# EAGLE design powerlinecontroller (EAGLE 5.08)
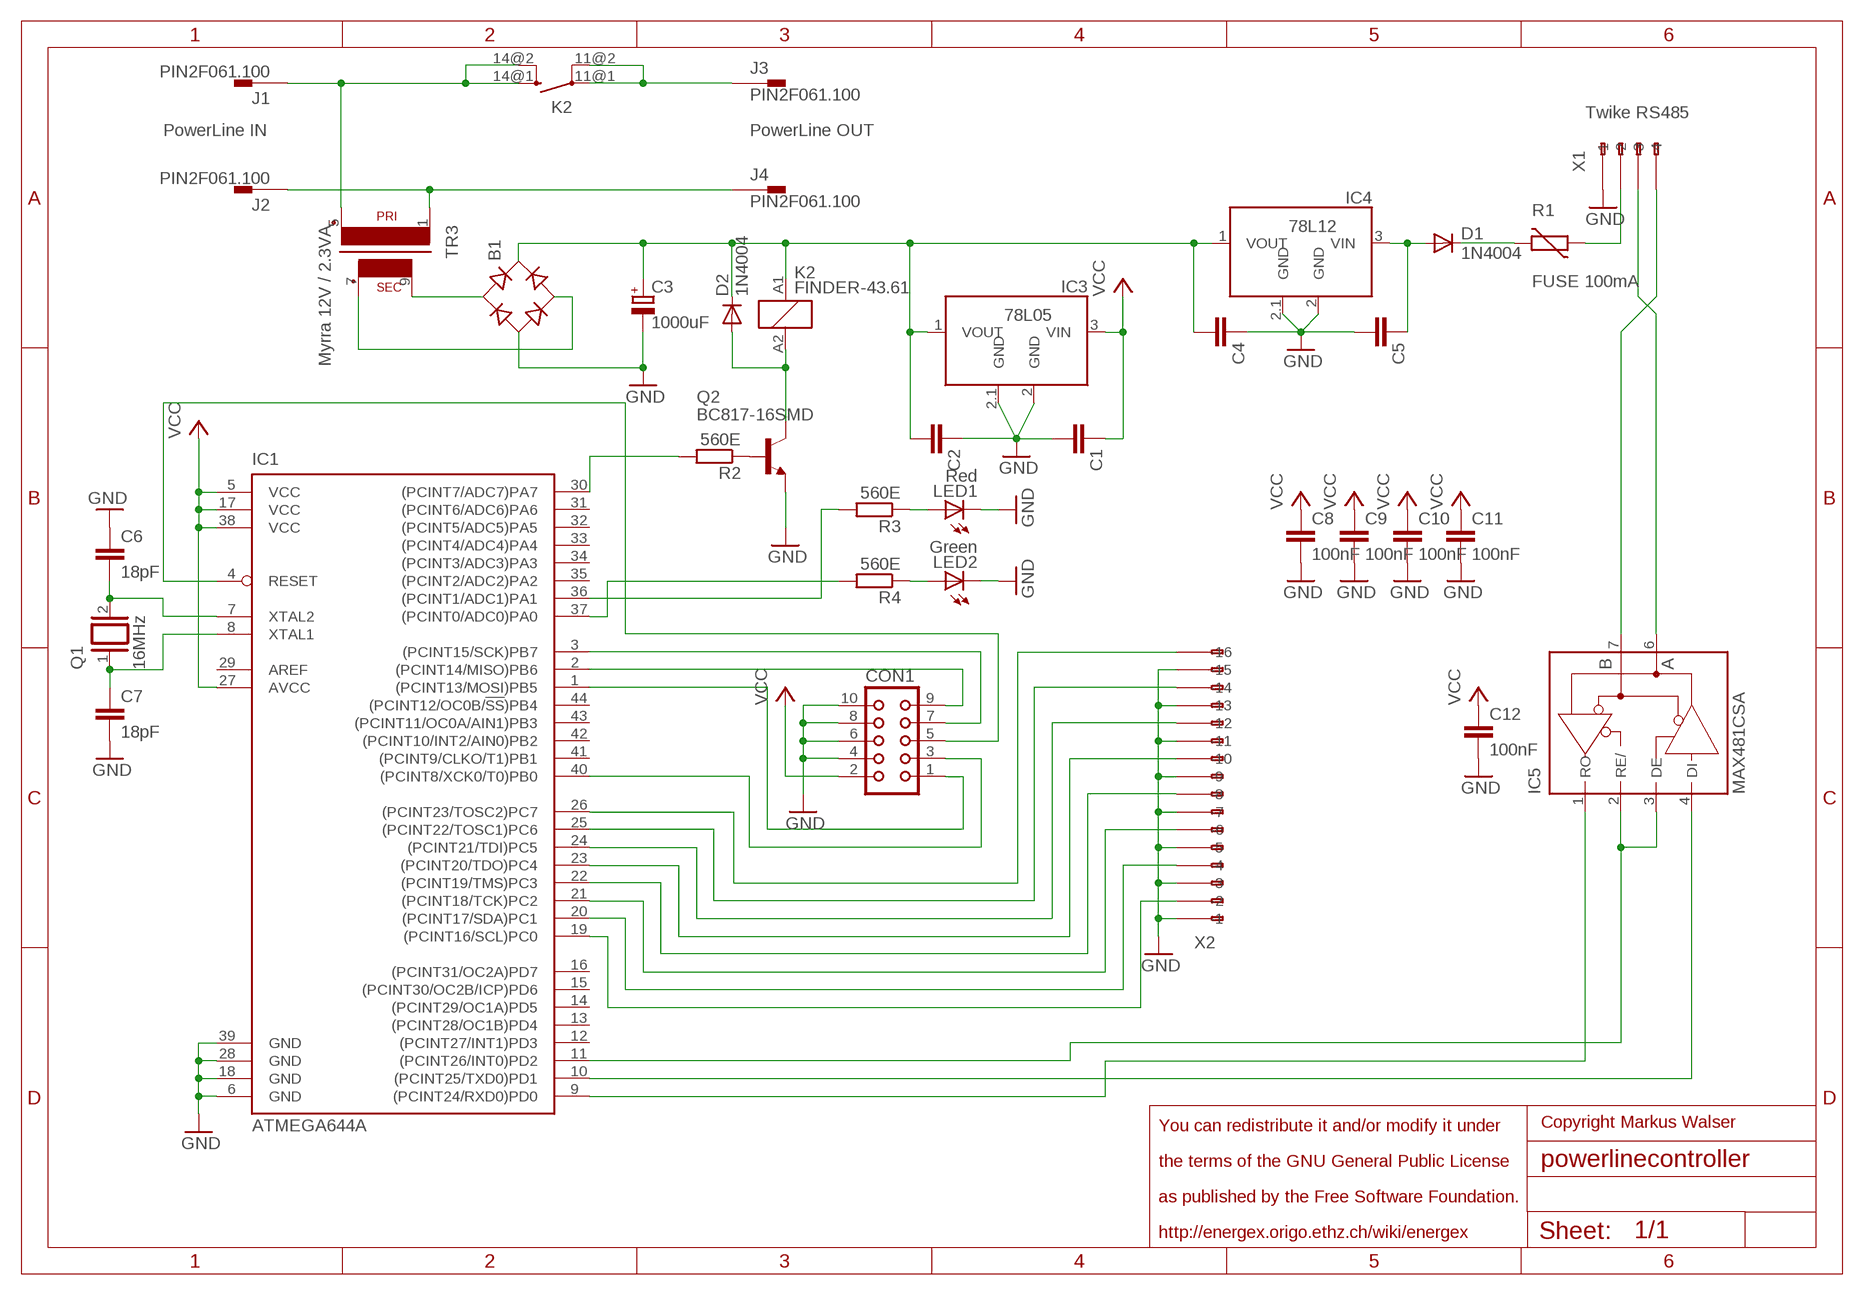
[diagram p0: schematic, sheet 1]

## Parts
B1  B-DIL  [B-DIL]
C1  C-EUC0603  [C0603]
C2  C-EUC0603  [C0603]
C3  1000uF  CPOL-EUE3.5-10  [E3,5-10]
C4  C-EUC0603  [C0603]
C5  C-EUC0603  [C0603]
C6  18pF  C-EUC0603K  [C0603K]
C7  18pF  C-EUC0603K  [C0603K]
C8  100nF  C-EUC0603  [C0603]
C9  100nF  C-EUC0603  [C0603]
C10  100nF  C-EUC0603  [C0603]
C11  100nF  C-EUC0603  [C0603]
C12  100nF  C-EUC0603  [C0603]
CON1  CON10  [CON10]
D1  1N4004  [DO41-10]
D2  1N4004  [DO41-10]
IC1  ATMEGA644A  [TQFP44]
IC3  78L05  [SOT89]
IC4  78L12  78L05  [SOT89]
IC5  MAX481CSA  [SO08]
J1  PIN2F061.100  [F061.100]
J2  PIN2F061.100  [F061.100]
J3  PIN2F061.100  [F061.100]
J4  PIN2F061.100  [F061.100]
K2  FINDER-43.61  [FINDER-43.61]
LED1  Red  LEDCHIPLED_0805  [CHIPLED_0805]
LED2  Green  LEDCHIPLED_0805  [CHIPLED_0805]
Q1  16MHz  XTAL/S  [QS]
Q2  BC817-16SMD  [SOT23-BEC]
R1  FUSE 100mA  VARISTORCN0805  [CT/CN0805]
R2  560E  R-EU_M0805  [M0805]
R3  560E  R-EU_M0805  [M0805]
R4  560E  R-EU_M0805  [M0805]
TR3  Myrra 12V / 2.3VA  VV11  [VV11]
X1  233-104  [233-104]
X2  233-116  [233-116]

## Nets
GND: B1.- C1.2 C2.1 C3.- C4.1 C5.2 C6.1 C7.2 C8.2 C9.2 C10.2 C11.2 C12.2 CON1.4 CON1.6 CON1.8 CON1.10 IC1.6(GND) IC1.18(GND) IC1.28(GND) IC1.39(GND) IC3.2(GND) IC3.2.1(GND) IC4.2(GND) IC4.2.1(GND) LED1.C LED2.C Q2.E X1.A1(-1) X2.A1(-1) X2.A3(-3) X2.A5(-5) X2.A7(-7) X2.A9(-9) X2.A11(-11) X2.A13(-13) X2.A15(-15)
N$1: IC1.9((PCINT24/RXD0)PD0) IC5.1(RO)
N$2: IC1.10((PCINT25/TXD0)PD1) IC5.4(DI)
N$3: D1.C R1.2
N$4: R1.1 X1.A2(-2)
N$5: B1.+ C2.2 C3.+ C4.2 D2.C IC3.1(VOUT) IC4.1(VOUT) K2.A1
N$6: J2.A1 J4.A1 TR3.1
N$7: J1.A1 K2.14@1(-1:SA) K2.14@2(-1:SB) TR3.5(P2)
N$8: J3.A1 K2.11@1(-1:PA) K2.11@2(-1:PB)
N$9: B1.AC1 TR3.9(S4)
N$10: B1.AC2 TR3.7(S3)
N$11: IC5.6(A) X1.A3(-3)
N$12: C5.1 D1.A IC4.3(VIN)
N$13: IC5.7(B) X1.A4(-4)
N$14: C6.2 IC1.7(XTAL2) Q1.2
N$15: C7.1 IC1.8(XTAL1) Q1.1
N$16: Q2.B R2.1
N$17: CON1.1 IC1.1((PCINT13/MOSI)PB5)
N$18: CON1.3 IC1.40((PCINT8/XCK0/T0)PB0)
N$19: CON1.5 IC1.4(RESET)
N$20: CON1.7 IC1.3((PCINT15/SCK)PB7)
N$21: CON1.9 IC1.2((PCINT14/MISO)PB6)
N$22: D2.A K2.A2 Q2.C
N$23: IC1.30((PCINT7/ADC7)PA7) R2.2
N$24: IC1.37((PCINT0/ADC0)PA0) R4.2
N$25: IC1.36((PCINT1/ADC1)PA1) R3.2
N$26: LED1.A R3.1
N$27: LED2.A R4.1
N$28: IC1.19((PCINT16/SCL)PC0) X2.A2(-2)
N$29: IC1.20((PCINT17/SDA)PC1) X2.A4(-4)
N$30: IC1.21((PCINT18/TCK)PC2) X2.A6(-6)
N$31: IC1.22((PCINT19/TMS)PC3) X2.A8(-8)
N$32: IC1.23((PCINT20/TDO)PC4) X2.A10(-10)
N$33: IC1.24((PCINT21/TDI)PC5) X2.A12(-12)
N$34: IC1.11((PCINT26/INT0)PD2) IC5.2(RE/) IC5.3(DE)
N$35: IC1.25((PCINT22/TOSC1)PC6) X2.A14(-14)
N$36: IC1.26((PCINT23/TOSC2)PC7) X2.A16(-16)
VCC: C1.1 C8.1 C9.1 C10.1 C11.1 C12.1 CON1.2 IC1.5(VCC) IC1.17(VCC) IC1.27(AVCC) IC1.38(VCC) IC3.3(VIN)
Unconnected: IC1.12((PCINT27/INT1)PD3) IC1.13((PCINT28/OC1B)PD4) IC1.14((PCINT29/OC1A)PD5) IC1.15((PCINT30/OC2B/ICP)PD6) IC1.16((PCINT31/OC2A)PD7) IC1.29(AREF) IC1.31((PCINT6/ADC6)PA6) IC1.32((PCINT5/ADC5)PA5) IC1.33((PCINT4/ADC4)PA4) IC1.34((PCINT3/ADC3)PA3) IC1.35((PCINT2/ADC2)PA2) IC1.41((PCINT9/CLKO/T1)PB1) IC1.42((PCINT10/INT2/AIN0)PB2) IC1.43((PCINT11/OC0A/AIN1)PB3) IC1.44((PCINT12/OC0B/!SS!)PB4) J1.A2(1.1) J2.A2(1.1) J3.A2(1.1) J4.A2(1.1) X1.B1(B-1) X1.B2(B-2) X1.B3(B-3) X1.B4(B-4) X2.B1(B-1) X2.B2(B-2) X2.B3(B-3) X2.B4(B-4) X2.B5(B-5) X2.B6(B-6) X2.B7(B-7) X2.B8(B-8) X2.B9(B-9) X2.B10(B-10) X2.B11(B-11) X2.B12(B-12) X2.B13(B-13) X2.B14(B-14) X2.B15(B-15) X2.B16(B-16)

## Notes on the sheet
- Twike RS485
- PowerLine IN | PowerLine OUT
- You can redistribute it and/or modify it under | Copyright Markus Walser
- the terms of the GNU General Public License
- as published by the Free Software Foundation.
- http://energex.origo.ethz.ch/wiki/energex

## Power pins joined to a net without a drawn wire
GND: IC5.5(GND)
VCC: IC5.8(VCC)

## Library data of the parts
B1 = rectifier:B-DIL: RECTIFIER
C1 C2 C4-C12 = rcl:C-EU: CAPACITOR, European symbol
C3 = rcl:CPOL-EU: POLARIZED CAPACITOR, European symbol
CON1 = con-harting:CON10: CONNECTOR
D1 D2 = diode:1N4004: DIODE general purpose rectifier, 1 A
IC1 = atmel:ATMEGA644: 8-bit Microcontroller with 64K Bytes In-System Programmable Flash Source: http://www.atmel.com/dyn/resources/prod_documents/doc2593.pdf
IC3 IC4 = supervisor:78L05: Negative voltage regulators
IC5 = maxim:MAX481CSA: RS485 TRANSEIVER
J1-J4 = con-faston:PIN2: Flachstecker Typ Tyco/Electronics/AMP TAB, FASTON Printed Circuit Board Tabs Source: http://www.buerklin.com, http://catalog.tycoelectronics.com
K2 = relay:FINDER-43.61: Low profile PCB relays 10 - 16 A FINDER 43 Series Kontakt max. AC- 250V, Strom - Kontakt AC- max. 10A 5 mm contact pin pitch, 1 Pole NO, 16 A, PCB mount Distributor: FARNELL Source: http://www.farnell.com/datasheets/87682.pdf
LED1 LED2 = led:LED: LED OSRAM: - CHIPLED LG R971, LG N971, LY N971, LG Q971, LY Q971, LO R971, LY R971 LH N974, LH R974 LS Q976, LO Q976, LY Q976 LO Q996 - Hyper CHIPLED LW Q18S LB Q993, LB Q99A, LB R99A - SideLED LS A670, LO A670, LY A670, LG A670, LP A670 LB A673, LV A673, LT A673, LW A673 LH A674 LY A675 LS A676, LA A676, LO A676, LY A676, LW A676 LS A679, LY A679, LG A679 - Hyper Micro SIDELED® LS Y876, LA Y876, LO Y876, LY Y876 LT Y87S - SmartLED LW L88C, LW L88S LB L89C, LB L89S, LG L890 LS L89K, LO L89K, LY L89K LS L896, LA L896, LO L896, LY L896 - TOPLED LS T670, LO T670, LY T670, LG T670, LP T670 LSG T670, LSP T670, LSY T670, LOP T670, LYG T670 LG T671, LOG T671, LSG T671 LB T673, LV T673, LT T673, LW T673 LH T674 LS T676, LA T676, LO T676, LY T676, LB T676, LH T676, LSB T676, LW T676 LB T67C, LV T67C, LT T67C, LS T67K, LO T67K, LY T67K, LW E67C LS E67B, LA E67B, LO E67B, LY E67B, LB E67C, LV E67C, LT E67C LW T67C LS T679, LY T679, LG T679 LS T770, LO T770, LY T770, LG T770, LP T770 LB T773, LV T773, LT T773, LW T773 LH T774 LS E675, LA E675, LY E675, LS T675 LS T776, LA T776, LO T776, LY T776, LB T776 LHGB T686 LT T68C, LB T68C - Hyper Mini TOPLED® LB M676 - Mini TOPLED Santana® LG M470 LS M47K, LO M47K, LY M47K Source: http://www.osram.convergy.de LUXEON: - LUMILED® LXK2-PW12-R00, LXK2-PW12-S00, LXK2-PW14-U00, LXK2-PW14-V00 LXK2-PM12-R00, LXK2-PM12-S00, LXK2-PM14-U00 LXK2-PE12-Q00, LXK2-PE12-R00, LXK2-PE12-S00, LXK2-PE14-T00, LXK2-PE14-U00 LXK2-PB12-K00, LXK2-PB12-L00, LXK2-PB12-M00, LXK2-PB14-N00, LXK2-PB14-P00, LXK2-PB14-Q00 LXK2-PR12-L00, LXK2-PR12-M00, LXK2-PR14-Q00, LXK2-PR14-R00 LXK2-PD12-Q00, LXK2-PD12-R00, LXK2-PD12-S00 LXK2-PH12-R00, LXK2-PH12-S00 LXK2-PL12-P00, LXK2-PL12-Q00, LXK2-PL12-R00 Source: www.luxeon.com KINGBRIGHT: KA-3528ASYC Source: www.kingbright.com
Q1 = special:XTAL/S: CRYSTAL
Q2 = transistor-npn:BC817*: NPN Transistor
R1 = varistor:VARISTOR: VARISTOR
R2-R4 = rcl:R-EU_: RESISTOR, European symbol
TR3 = trafo:VV11: TRANSFORMER 1 primary winding, 1 secondary winding BLOCK
X1 = con-wago:233-104: WAGO Cage Clamp
X2 = con-wago:233-116: WAGO Cage Clamp

## Board
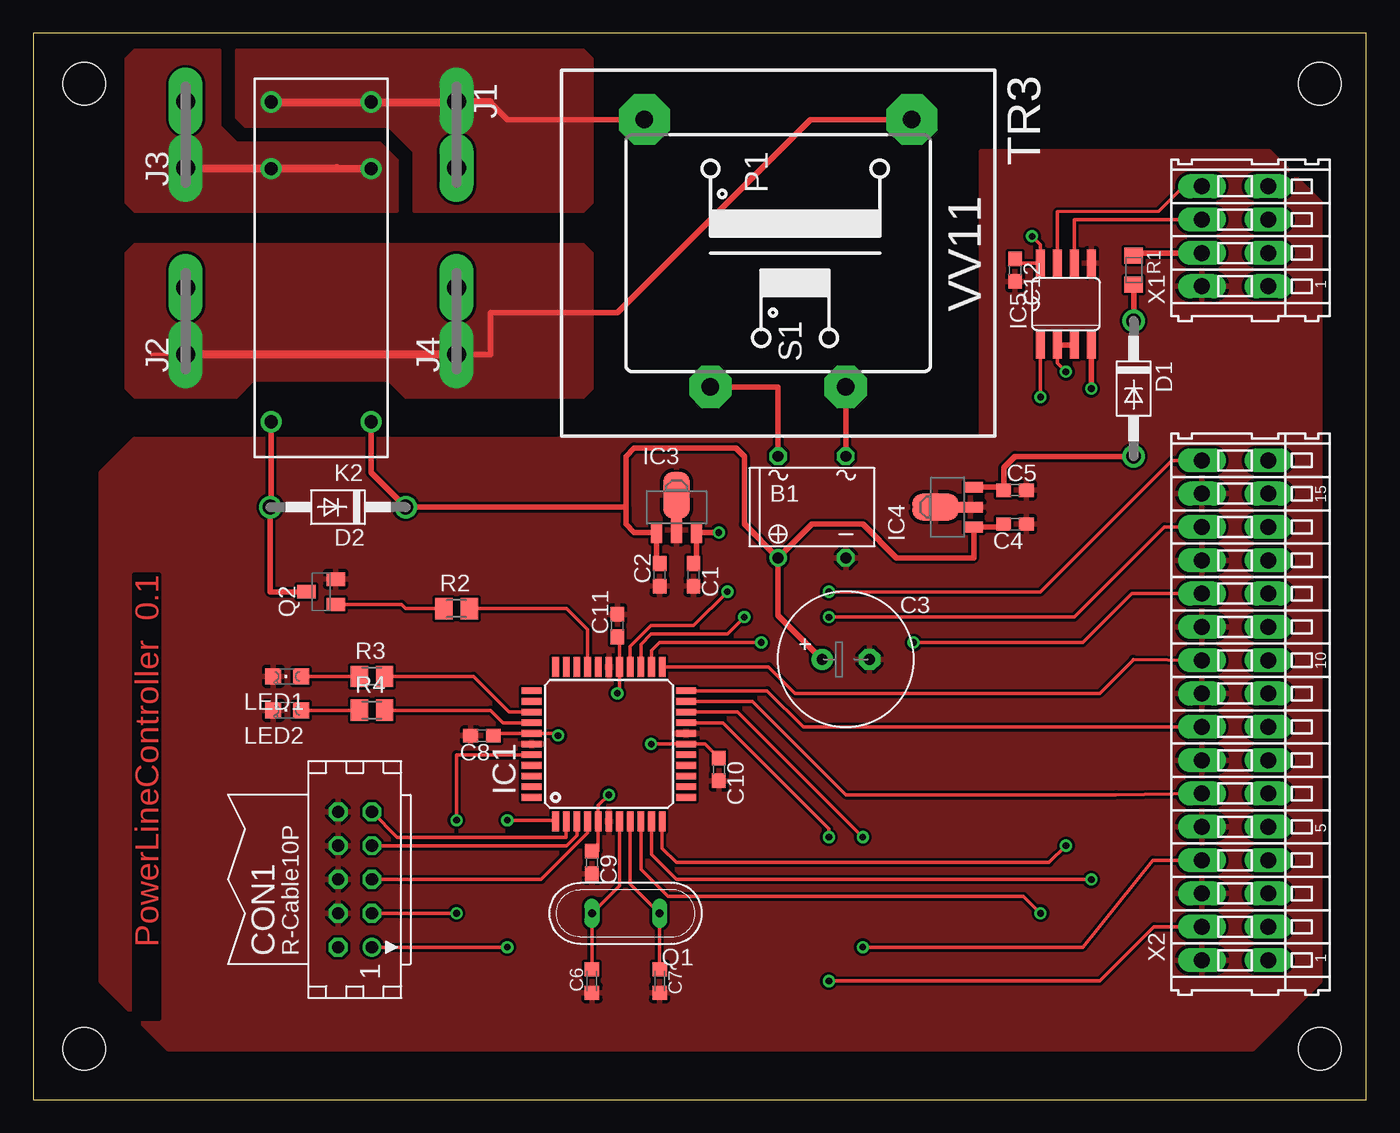
[diagram p1: board, top side]
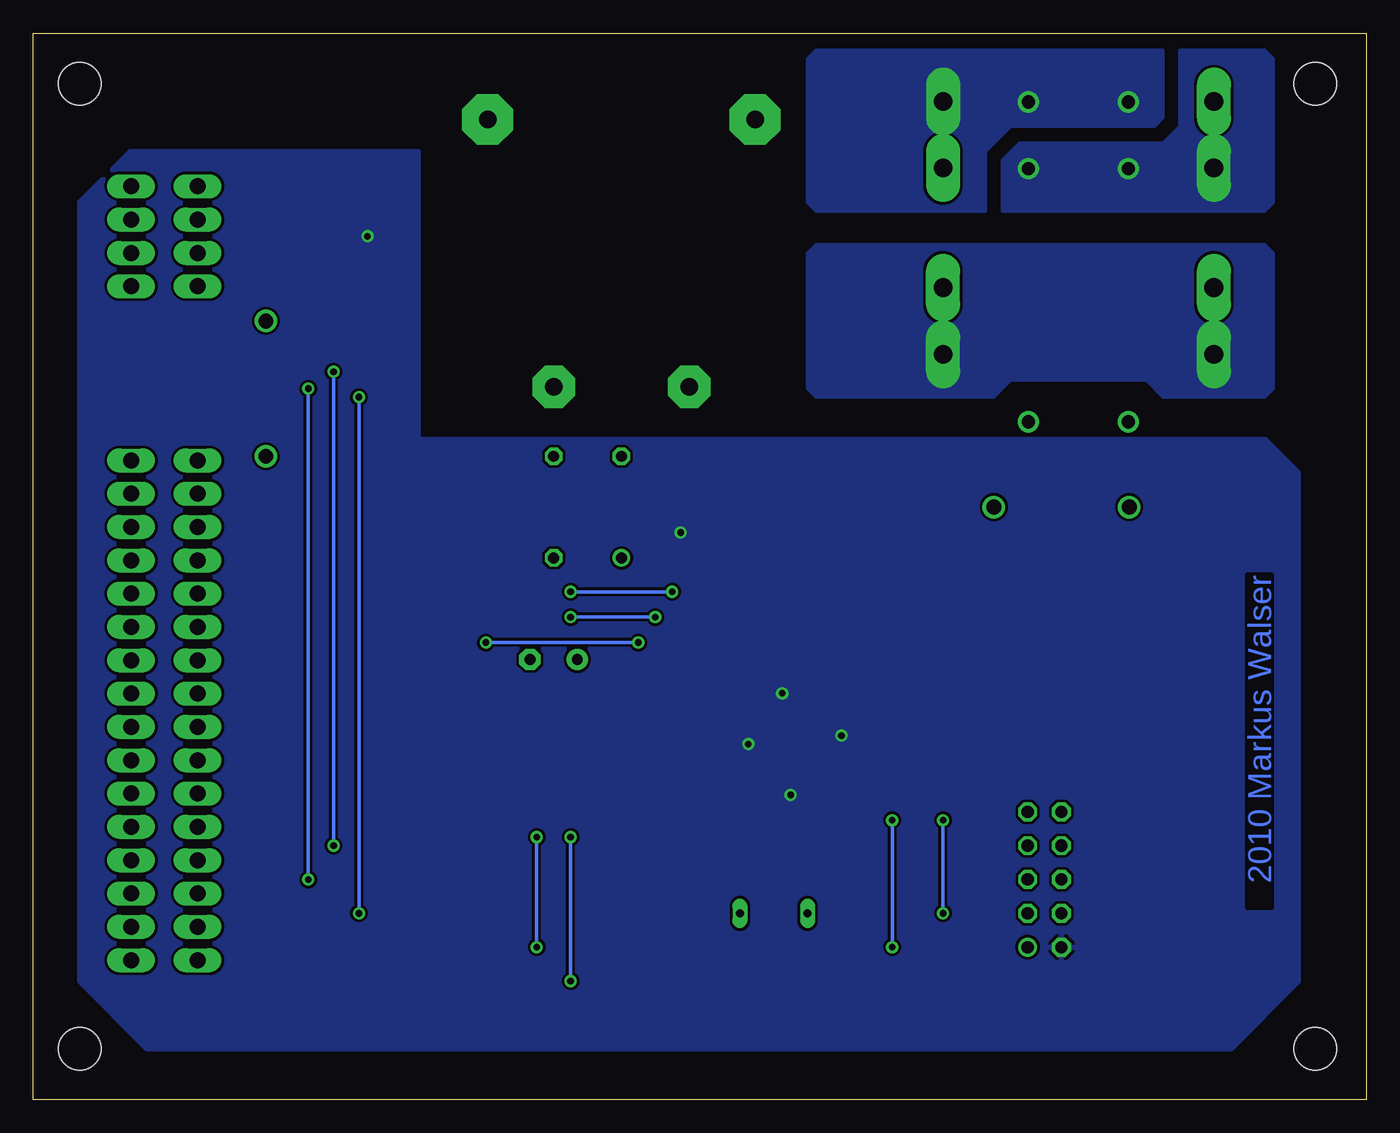
[diagram p2: board, bottom side, seen from below]

Size 100 x 80 mm. Coordinates in mm from the lower left corner, seen from the top.
Outline: 0,0 100,0 100,80 0,80 0,0
Copper layers (1*16): Top 0.035mm / dielectric 1.5mm / Bottom 0.035mm
Design rules "default": minimum track width 10mil, minimum drill 24mil, track to track 8mil, track to pad 8mil, pad to pad 8mil, via to via 8mil, smd to smd 8mil, copper to edge 40mil, drill to drill 8mil, minimum pad ring 10mil, minimum via ring 8mil, stop-mask expansion 4mil, vias tented up to drill 0mil, thermal gap 10mil
Holes 3.2 mm at 3.81,76.2 96.52,76.2 96.52,3.81 3.81,3.81

### Footprints (pad centres in the part's own frame; a part is rotated, then mirrored left to right if it is on the bottom)
B-DIL = drill 0.813 round: + -2.54,-3.81 | drill 0.813 octagon: - 2.54,-3.81; AC1 2.54,3.81; AC2 -2.54,3.81
C0603 = smd 1.1 x 1: 1 -0.85,0; 2 0.85,0
E3,5-10 = drill 0.813 pad 1.6 round: + -1.778,0 | drill 0.813 pad 1.6 octagon: - 1.778,0
C0603K = smd 1.05 x 1.08: 1 -0.875,0; 2 0.875,0
CON10 = drill 0.914 round: 1 -5.08,-1.27 | drill 0.914 octagon: 2 -5.08,1.27; 3 -2.54,-1.27; 4 -2.54,1.27; 5 0,-1.27; 6 0,1.27; 7 2.54,-1.27; 8 2.54,1.27; 9 5.08,-1.27; 10 5.08,1.27
DO41-10 = drill 1.118 round: A 5.08,0; C -5.08,0
TQFP44 = smd 1.5 x 0.5: 1 -5.8,4; 2 -5.8,3.2; 3 -5.8,2.4; 4 -5.8,1.6; 5 -5.8,0.8; 6 -5.8,0; 7 -5.8,-0.8; 8 -5.8,-1.6; 9 -5.8,-2.4; 10 -5.8,-3.2; 11 -5.8,-4; 23 5.8,-4; 24 5.8,-3.2; 25 5.8,-2.4; 26 5.8,-1.6; 27 5.8,-0.8; 28 5.8,0; 29 5.8,0.8; 30 5.8,1.6; 31 5.8,2.4; 32 5.8,3.2; 33 5.8,4 | smd 0.5 x 1.5: 12 -4,-5.8; 13 -3.2,-5.8; 14 -2.4,-5.8; 15 -1.6,-5.8; 16 -0.8,-5.8; 17 0,-5.8; 18 0.8,-5.8; 19 1.6,-5.8; 20 2.4,-5.8; 21 3.2,-5.8; 22 4,-5.8; 34 4,5.8; 35 3.2,5.8; 36 2.4,5.8; 37 1.6,5.8; 38 0.8,5.8; 39 0,5.8; 40 -0.8,5.8; 41 -1.6,5.8; 42 -2.4,5.8; 43 -3.2,5.8; 44 -4,5.8
SOT89 = smd 0.8 x 1.4: 1 -1.499,-1.981; 3 1.499,-1.981 | smd 0.8 x 1.9: 2 0,-1.727 | smd 2 x 3.5: 2.1 0,0.889
SO08 = smd 0.66 x 2.032: 1 -1.905,-3.073; 2 -0.635,-3.073; 3 0.635,-3.073; 4 1.905,-3.073; 5 1.905,3.073; 6 0.635,3.073; 7 -0.635,3.073; 8 -1.905,3.073
F061.100 = drill 1.4 pad 2.54 long: A1 -2.5,0; A2 2.5,0
FINDER-43.61 = drill 1 pad 1.6 round: 11@1 0,3.75; 11@2 0,-3.75; 14@1 5,3.75; 14@2 5,-3.75; A1 -19,-3.75; A2 -19,3.75
CHIPLED_0805 = smd 1.2 x 1.2: A 0,-1.05; C 0,1.05
QS = drill 0.61 long: 1 -2.54,0; 2 2.54,0
SOT23-BEC = smd 1 x 1.4: B -0.95,-1.1; C 0,1.1; E 0.95,-1.1
CT/CN0805 = smd 1.2 x 1.4: 1 -1.1,0; 2 1.1,0
M0805 = smd 1.3 x 1.6: 1 -0.95,0; 2 0.95,0
VV11 = drill 1.321 pad 3.81 octagon: 1 -10.033,10.033; 5 -10.033,-10.033 | drill 1.321 pad 3.175 octagon: 7 10.033,-5.08; 9 10.033,5.08
233-104 = drill 1.2 long: A1 -3.75,2.5; A2 -1.25,2.5; A3 1.25,2.5; A4 3.75,2.5; B1 -3.75,-2.5; B2 -1.25,-2.5; B3 1.25,-2.5; B4 3.75,-2.5
233-116 = drill 1.2 long: A1 -18.75,2.5; A2 -16.25,2.5; A3 -13.75,2.5; A4 -11.25,2.5; A5 -8.75,2.5; A6 -6.25,2.5; A7 -3.75,2.5; A8 -1.25,2.5; A9 1.25,2.5; A10 3.75,2.5; A11 6.25,2.5; A12 8.75,2.5; A13 11.25,2.5; A14 13.75,2.5; A15 16.25,2.5; A16 18.75,2.5; B1 -18.75,-2.5; B2 -16.25,-2.5; B3 -13.75,-2.5; B4 -11.25,-2.5; B5 -8.75,-2.5; B6 -6.25,-2.5; B7 -3.75,-2.5; B8 -1.25,-2.5; B9 1.25,-2.5; B10 3.75,-2.5; B11 6.25,-2.5; B12 8.75,-2.5; B13 11.25,-2.5; B14 13.75,-2.5; B15 16.25,-2.5; B16 18.75,-2.5

### Placement (x,y rotation side)
B1  58.42,44.45 0 top
C1  49.53,39.37 270 top
C2  46.99,39.37 90 top
C3  60.96,33.02 0 top
C4  73.66,43.18 180 top
C5  73.66,45.72 0 top
C6  41.91,8.89 90 top
C7  46.99,8.89 270 top
C8  33.66,27.3 180 top
C9  41.91,17.78 270 top
C10  51.44,24.77 270 top
C11  43.81,35.56 90 top
C12  73.66,62.23 270 top
CON1  24.13,16.51 90 top
D1  82.55,53.34 270 top
D2  22.86,44.45 180 top
IC1  43.18,26.67 90 top
IC3  48.26,44.45 0 top
IC4  68.58,44.45 90 top
IC5  77.47,59.69 0 top
J1  31.75,72.39 270 top
J2  11.43,58.42 90 top
J3  11.43,72.39 90 top
J4  31.75,58.42 90 top
K2  21.59,69.85 90 top
LED1  19.05,31.75 90 top
LED2  19.05,29.21 90 top
Q1  44.45,13.97 180 top
Q2  21.59,38.1 90 top
R1  82.55,62.23 270 top
R2  31.75,36.83 0 top
R3  25.4,31.75 0 top
R4  25.4,29.21 0 top
TR3  55.88,63.5 270 top
X1  90.17,64.77 90 top
X2  90.17,29.21 90 top

### Tracks (layer width: path | path; a pad name or v marks a point on that pad's centre or on a via)
GND
  Top 0.406: IC4.2.1 IC4.2 | IC3.2 IC3.2.1
  pour Top: 5.08,8.89 5.08,46.99 7.62,49.53 71.12,49.53 71.12,71.12 92.71,71.12 96.52,67.31 96.52,8.89 91.44,3.81 10.16,3.81
N$1  (via drill 0.5)
  Top 0.254: v75.56,52.7 IC5.1 | v75.56,13.97 74.3,15.24 47.62,15.24 45.58,17.29 IC1.9
  Bottom 0.254: v75.56,13.97 v75.56,52.7
N$2  (via drill 0.5)
  Top 0.254: v79.38,16.51 48.26,16.51 46.38,18.39 IC1.10
  Top 0.406: v79.38,53.34 IC5.4
  Bottom 0.254: v79.38,16.51 v79.38,53.34
N$3
  Top 0.406: D1.C R1.2
N$4
  Top 0.406: X1.A2 82.55,63.52 R1.1
N$5
  Top 0.254: 46.76,40.22 C2.2
  Top 0.406: 46.76,40.22 IC3.1 46.69,42.55 45.09,42.55 44.45,43.18 44.45,44.45 | B1.+ 53.34,43.18 53.34,48.26 52.7,48.9 45.09,48.9 44.45,48.26 44.45,44.45 | 44.45,44.45 D2.C 25.34,47.05 K2.A1 | B1.+ 55.88,36.32 C3.+ | B1.+ 58.42,43.18 62.23,43.18 64.77,40.64 70.56,40.64 IC4.1 72.81,42.95 C4.2
N$6
  Top 0.254: 8.89,55.88 J2.A1 | J4.A1 30.48,55.88
  Top 0.406: TR3.1 58.29,73.53 43.81,59.05 34.29,59.05 34.29,55.88 31.79,55.88 J4.A1
  Top 0.61: J2.A1 J4.A1
  pour Top (no thermals): 6.99,53.34 7.62,52.7 15.24,52.7 16.51,53.98 26.67,53.98 27.94,52.7 41.27,52.7 41.91,53.34 41.91,63.5 41.27,64.14 7.62,64.14 6.99,63.5
  pour Bottom (no thermals): 7.62,64.14 41.27,64.14 41.91,63.5 41.91,53.34 41.27,52.7 27.94,52.7 26.67,53.98 16.51,53.98 15.24,52.7 7.62,52.7 6.99,53.34 6.99,63.5
N$7
  Top 0.406: TR3.5 35.57,73.53 34.25,74.85
  Top 0.61: K2.14@1 K2.14@2 34.25,74.85 J1.A1
  pour Top (no thermals): 15.24,73.66 15.24,78.74 41.27,78.74 41.91,78.11 41.91,67.31 41.27,66.67 28.57,66.67 28.57,71.12 26.67,73.03 15.88,73.03
  pour Bottom (no thermals): 15.24,78.74 41.27,78.74 41.91,78.11 41.91,67.31 41.27,66.67 28.57,66.67 28.57,71.12 26.67,73.03 15.88,73.03 15.24,73.66
N$8
  Top 0.254: K2.11@1 11.47,69.85 J3.A1
  Top 0.61: J3.A1 22.76,69.89 K2.11@2
  pour Top (no thermals): 7.62,78.74 13.97,78.74 13.97,73.03 15.24,71.75 26.04,71.75 27.3,70.48 27.3,66.67 7.62,66.67 6.99,67.31 6.99,78.11
  pour Bottom (no thermals): 13.97,78.74 13.97,73.03 15.24,71.75 26.04,71.75 27.3,70.48 27.3,66.67 7.62,66.67 6.99,67.31 6.99,78.11 7.62,78.74
N$9
  Top 0.406: B1.AC1 TR3.9
N$10
  Top 0.406: TR3.7 55.88,53.47 B1.AC2
N$11
  Top 0.254: X1.A3 78.11,66.02 IC5.6
N$12
  Top 0.406: IC4.3 72.81,45.95 C5.1 72.81,47.41 73.66,48.26 D1.A
N$13
  Top 0.254: X1.A4 86.3,68.52 84.45,66.67 76.83,66.61 IC5.7
N$14
  Top 0.254: IC1.7 43.98,16.04 Q1.2 C6.2
N$15
  Top 0.254: IC1.8 44.78,16.18 Q1.1 C7.1
N$16
  Top 0.254: Q2.B 27.62,37.15 27.94,36.83 R2.1
N$17  (via drill 0.5)
  Top 0.254: CON1.1 v35.56,11.43 | v35.56,20.95 39.18,20.95 IC1.1
  Bottom 0.254: v35.56,11.43 v35.56,20.95
N$18  (via drill 0.5)
  Top 0.254: IC1.40 31.75,25.87 v31.75,20.95 | CON1.3 v31.75,13.97
  Bottom 0.254: v31.75,13.97 v31.75,20.95
N$19
  Top 0.254: IC1.4 41.58,19.99 38.1,16.51 CON1.5
N$20
  Top 0.254: IC1.3 40.78,19.82 40.01,19.05 CON1.7
N$21
  Top 0.254: CON1.9 27.3,19.68 39.98,19.68 IC1.2
N$22
  Top 0.406: Q2.C 17.78,38.1 D2.A 17.84,44.51 K2.A2
N$23
  Top 0.254: IC1.30 41.58,35.26 40.01,36.83 R2.2
N$24
  Top 0.254: IC1.37 35.23,28.27 34.29,29.21 R4.2
N$25
  Top 0.254: IC1.36 35.7,29.07 33.02,31.75 R3.2
N$26
  Top 0.254: LED1.A R3.1
N$27
  Top 0.254: LED2.A R4.1
N$28  (via drill 0.5)
  Top 0.254: X2.A2 84.08,12.96 80.01,8.89 v59.69,8.89 | IC1.19 51.74,28.27 59.69,20.32 v59.69,19.68
  Bottom 0.254: v59.69,8.89 v59.69,19.68
N$29  (via drill 0.5)
  Top 0.254: IC1.20 52.84,29.07 v62.23,19.68 | v62.23,11.43 78.74,11.43 84,17.96 X2.A4
  Bottom 0.254: v62.23,11.43 v62.23,19.68
N$30
  Top 0.254: IC1.21 53.95,29.87 60.96,22.86 81.22,22.86 X2.A6
N$31
  Top 0.254: IC1.22 55.05,30.67 57.78,27.94 86.38,27.94 X2.A8
N$32
  Top 0.254: IC1.23 55.16,32.47 57.15,30.48 80.01,30.48 82.53,33 82.53,33.02 X2.A10
N$33  (via drill 0.5)
  Top 0.254: X2.A12 82.41,37.96 78.74,34.29 v66.04,34.29 | v54.61,34.29 46.99,34.29 46.38,33.68 IC1.24
  Bottom 0.254: v54.61,34.29 v66.04,34.29
N$34  (via drill 0.5)
  Top 0.254: IC5.2 76.83,55.24 v77.47,54.61 | v77.47,19.05 76.2,17.78 48.26,17.78 47.18,18.86 IC1.11
  Top 0.406: IC5.2 IC5.3
  Bottom 0.254: v77.47,19.05 v77.47,54.61
N$35  (via drill 0.5)
  Top 0.254: IC1.25 45.58,34.15 46.35,34.92 52.07,34.92 v53.34,36.2 | v59.69,36.2 78.11,36.2 84.87,42.96 X2.A14
  Bottom 0.254: v53.34,36.2 v59.69,36.2
N$36  (via drill 0.5)
  Top 0.254: X2.A16 85.42,47.96 75.56,38.1 v59.69,38.1 | v52.07,38.1 49.53,35.56 46.35,35.56 44.78,33.98 IC1.26
  Bottom 0.254: v52.07,38.1 v59.69,38.1
VCC  (via drill 0.5)
  Top 0.254: v74.93,64.77 75.56,64.14 IC5.8 73.98,62.76 arc-90 C12.1 | C11.1 43.98,34.71 IC1.27 43.98,30.64 v43.81,30.48 | IC3.3 49.76,42.55 | C1.1 49.76,40.22 | C8.1 34.67,27.47 IC1.38 39.2,27.47 v39.37,27.3 | v43.18,22.86 42.38,22.06 IC1.5 42.38,18.67 C9.1 | v46.35,26.67 IC1.17 50.38,26.67 C10.1
  Top 0.406: 49.76,42.55 v51.44,42.55 | 49.76,40.22 IC3.3
  pour Bottom: 10.16,3.81 91.44,3.81 96.52,8.89 96.52,67.31 92.71,71.12 71.12,71.12 71.12,49.53 7.62,49.53 5.08,46.99 5.08,8.89

### Text on the board
Top: PowerLineController 0.1
Bottom: 2010 Markus Walser